# EAGLE schematic StackBreakoutConnection_4layers_V1.0_with_connector (EAGLE 9.1.0)

## Sheet 1 of 2
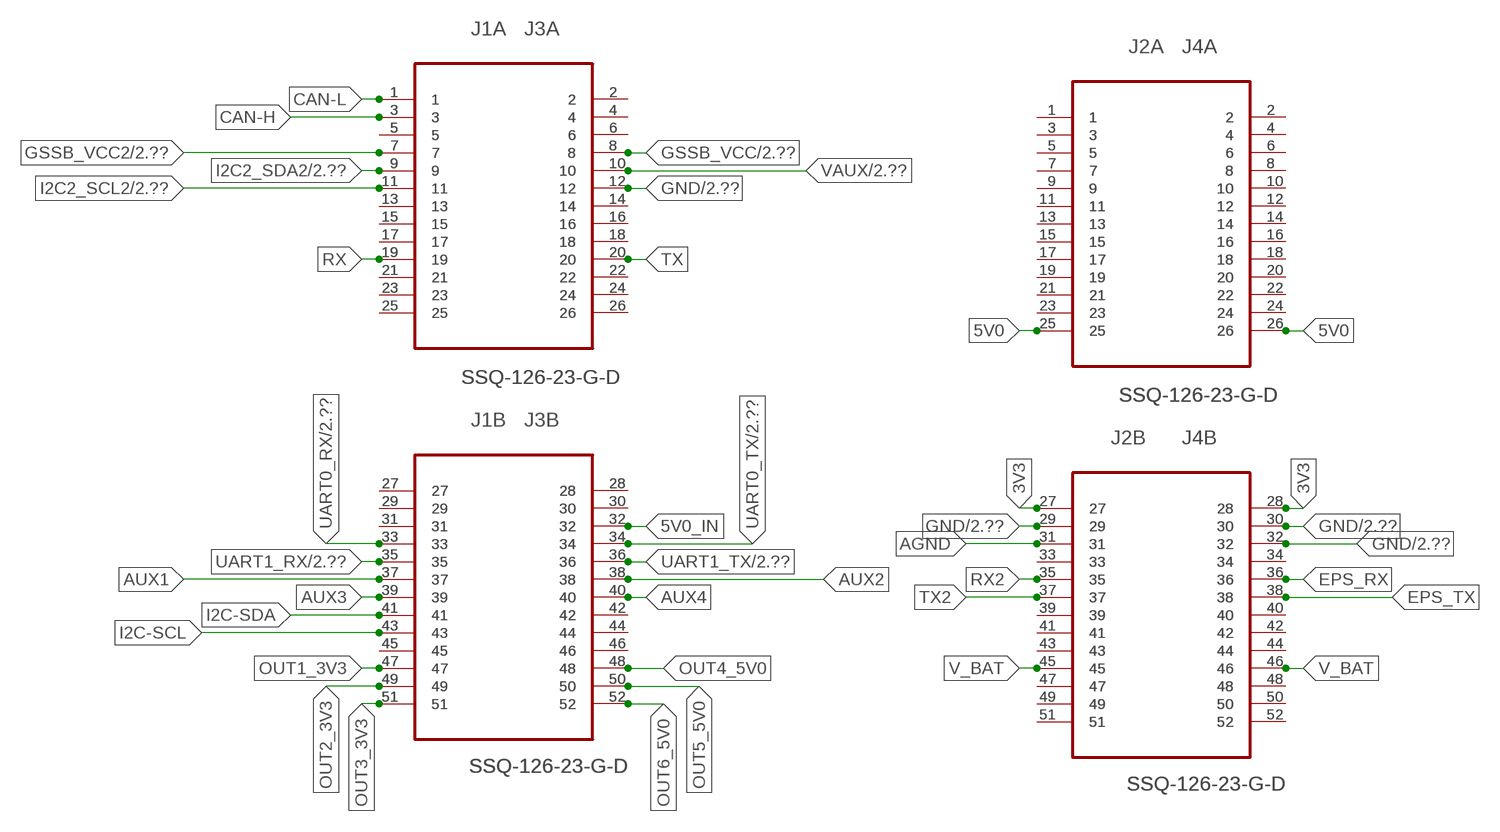
[diagram p0: schematic, sheet 1]

### Parts
J1  SSQ-126-23-G-D  [SAMTEC_SSQ-126-23-G-D]
J2  SSQ-126-23-G-D  [SAMTEC_SSQ-126-23-G-D]
J3  SSQ-126-23-G-D  [SAMTEC_SSQ-126-23-G-D]
J4  SSQ-126-23-G-D  [SAMTEC_SSQ-126-23-G-D]

### Nets
3V3: J2.27 J2.28 J4.27 J4.28
5V0: J2.25 J2.26 J4.25 J4.26
5V0_IN: J1.32 J3.32
AGND: J2.31 J4.31
AUX1: J1.37 J3.37
AUX2: J1.38 J3.38
AUX3: J1.39 J3.39
AUX4: J1.40 J3.40
CAN-H: J1.3 J3.3
CAN-L: J1.1 J3.1
EPS_RX: J2.36 J4.36
EPS_TX: J2.38 J4.38
GND: J1.12 J2.29 J2.30 J2.32 J3.12 J4.29 J4.30 J4.32 ; also sheet 2
GSSB_VCC: J1.8 J3.8 ; also sheet 2
GSSB_VCC2: J1.7 J3.7 ; also sheet 2
I2C2_SCL2: J1.11 J3.11 ; also sheet 2
I2C2_SDA2: J1.9 J3.9 ; also sheet 2
I2C-SCL: J1.43 J3.43
I2C-SDA: J1.41 J3.41
N$3: J1.5 J3.5
N$7: J1.13 J3.13
N$8: J1.15 J3.15
N$9: J1.17 J3.17
N$11: J1.21 J3.21
N$12: J1.23 J3.23
N$13: J1.25 J3.25
N$14: J1.2 J3.2
N$15: J1.4 J3.4
N$16: J1.6 J3.6
N$20: J1.14 J3.14
N$21: J1.16 J3.16
N$22: J1.18 J3.18
N$24: J1.22 J3.22
N$25: J1.24 J3.24
N$26: J1.26 J3.26
N$27: J1.27 J3.27
N$28: J1.29 J3.29
N$29: J1.31 J3.31
N$36: J1.45 J3.45
N$40: J1.28 J3.28
N$41: J1.30 J3.30
N$47: J1.42 J3.42
N$48: J1.44 J3.44
N$49: J1.46 J3.46
N$53: J2.1 J4.1
N$54: J2.3 J4.3
N$55: J2.5 J4.5
N$56: J2.7 J4.7
N$57: J2.9 J4.9
N$58: J2.11 J4.11
N$59: J2.13 J4.13
N$60: J2.15 J4.15
N$61: J2.17 J4.17
N$62: J2.19 J4.19
N$63: J2.21 J4.21
N$64: J2.23 J4.23
N$66: J2.2 J4.2
N$67: J2.4 J4.4
N$68: J2.6 J4.6
N$69: J2.8 J4.8
N$70: J2.10 J4.10
N$71: J2.12 J4.12
N$72: J2.14 J4.14
N$73: J2.16 J4.16
N$74: J2.18 J4.18
N$75: J2.20 J4.20
N$76: J2.22 J4.22
N$77: J2.24 J4.24
N$82: J2.33 J4.33
N$85: J2.39 J4.39
N$86: J2.41 J4.41
N$87: J2.43 J4.43
N$89: J2.47 J4.47
N$90: J2.49 J4.49
N$91: J2.51 J4.51
N$95: J2.34 J4.34
N$98: J2.40 J4.40
N$99: J2.42 J4.42
N$100: J2.44 J4.44
N$102: J2.48 J4.48
N$103: J2.50 J4.50
N$104: J2.52 J4.52
OUT1_3V3: J1.47 J3.47
OUT2_3V3: J1.49 J3.49
OUT3_3V3: J1.51 J3.51
OUT4_5V0: J1.48 J3.48
OUT5_5V0: J1.50 J3.50
OUT6_5V0: J1.52 J3.52
RX: J1.19 J3.19
RX2: J2.35 J4.35
TX: J1.20 J3.20
TX2: J2.37 J4.37
UART0_RX: J1.33 J3.33 ; also sheet 2
UART0_TX: J1.34 J3.34 ; also sheet 2
UART1_RX: J1.35 J3.35 ; also sheet 2
UART1_TX: J1.36 J3.36 ; also sheet 2
V_BAT: J2.45 J2.46 J4.45 J4.46
VAUX: J1.10 J3.10 ; also sheet 2

## Sheet 2 of 2
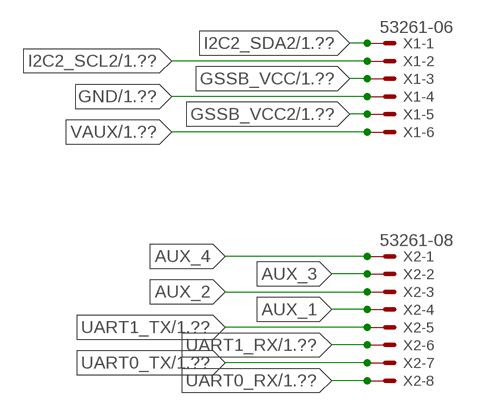
[diagram p1: schematic, sheet 2]

### Parts
X1  53261-06  [53261-06]
X2  53261-08  [53261-08]

### Nets
AUX_1: X2.4
AUX_2: X2.3
AUX_3: X2.2
AUX_4: X2.1
GND: X1.4 ; also sheet 1
GSSB_VCC: X1.3 ; also sheet 1
GSSB_VCC2: X1.5 ; also sheet 1
I2C2_SCL2: X1.2 ; also sheet 1
I2C2_SDA2: X1.1 ; also sheet 1
UART0_RX: X2.8 ; also sheet 1
UART0_TX: X2.7 ; also sheet 1
UART1_RX: X2.6 ; also sheet 1
UART1_TX: X2.5 ; also sheet 1
VAUX: X1.6 ; also sheet 1

## Library data of the parts
J1-J4 = SPEL:SSQ-126-23-G-D: CONN RECEPTACLE, 2.54MM, DUAL, 52WAY; MPN: SSQ-126-23-G-D; OC_FARNELL: -; OC_NEWARK: 82P0504; PACKAGE: RECEPTACLE, 2.54MM, DUAL, 52WAY; SUPPLIER: Samtec
X1 = con-molex:53?-06: CONNECTOR wire to board 1.25 mm (.049 inch) pitch header; MF: MOLEX; OC_FARNELL: 1125375; OC_NEWARK: unknown
X2 = con-molex:53?-08: CONNECTOR wire to board 1.25 mm (.049 inch) pitch header; MF: MOLEX; OC_FARNELL: 1125376; OC_NEWARK: unknown